# EAGLE design Interface (EAGLE 9.2.2)
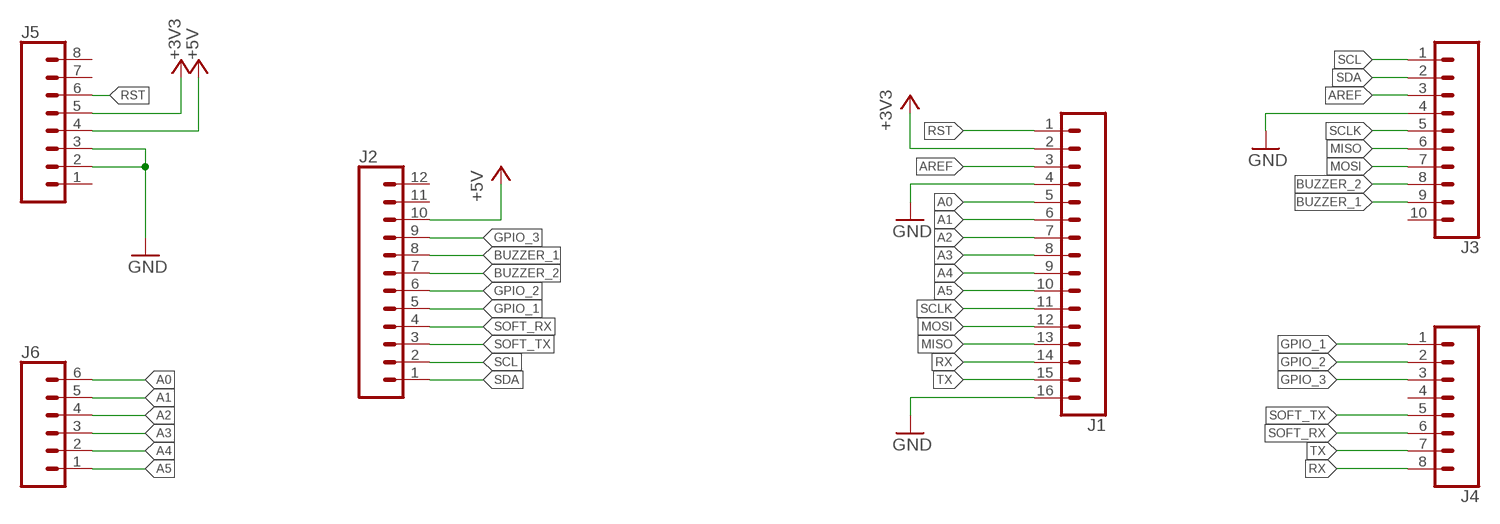
[diagram p0: schematic, sheet 1]

## Parts
J1  CONN_16  [1X16]
J2  CONN_12  [1X12]
J3  CONN_10"  [1X10]
J4  CONN_08"  [1X08]
J5  CONN_08"  [1X08]
J6  CONN_06SILK_FEMALE_PTH  [1X06]

## Nets
+3V3: J1.2 J5.5
+5V: J2.10 J5.4
A0: J1.5 J6.6
A1: J1.6 J6.5
A2: J1.7 J6.4
A3: J1.8 J6.3
A4: J1.9 J6.2
A5: J1.10 J6.1
AREF: J1.3 J3.3
BUZZER_1: J2.8 J3.9
BUZZER_2: J2.7 J3.8
GND: J1.4 J1.16 J3.4 J5.2 J5.3
GPIO_1: J2.5 J4.1
GPIO_2: J2.6 J4.2
GPIO_3: J2.9 J4.3
MISO: J1.13 J3.6
MOSI: J1.12 J3.7
RST: J1.1 J5.6
RX: J1.14 J4.8
SCL: J2.2 J3.1
SCLK: J1.11 J3.5
SDA: J2.1 J3.2
SOFT_RX: J2.4 J4.6
SOFT_TX: J2.3 J4.5
TX: J1.15 J4.7
Unconnected: J2.11 J2.12 J3.10 J4.4 J5.1 J5.7 J5.8

## Library data of the parts
J1 = SparkFun-Connectors:CONN_16: Multi connection point. Often used as Generic Header-pin footprint for 0.1 inch spaced/style header connections On any of the 0.1 inch spaced packages, you can populate with these: Break Away Headers - Straight <https://www.sparkfun.com/products/116> (PRT-00116) Break Away Male Headers - Right Angle <https://www.sparkfun.com/products/553> (PRT-00553) Female Headers <https://www.sparkfun.com/products/115> (PRT-00115) Break Away Headers - Machine Pin <https://www.sparkfun.com/products/117> (PRT-00117) Break Away Female Headers - Swiss Machine Pin <https://www.sparkfun.com/products/743> (PRT-00743) For SCREWTERMINALS and SPRING TERMINALS visit here: Screw Terimnals on SparkFun.com <https://www.sparkfun.com/search/results?term=Screw+Terminals> (5mm/3.5mm/2.54mm spacing) This device is also useful as a general connection point to wire up your design to another part of your project. Our various solder wires solder well into these plated through hole pads. Hook-Up Wire - Assortment (Stranded, 22 AWG) <https://www.sparkfun.com/products/11375> (PRT-11375) Hook-Up Wire - Assortment (Solid Core, 22 AWG) <https://www.sparkfun.com/products/11367> (PRT-11367) View the entire wire category on our website here <https://www.sparkfun.com/categories/141> Special notes: Molex polarized connector foot print use with SKU : PRT-08231 with associated crimp pins and housings. 1MM SMD Version SKU: PRT-10208 NOTES ON THE VARIANTS LOCK and LOCK_LONGPADS... This footprint was designed to help hold the alignment of a through-hole component (i.e. 6-pin header) while soldering it into place. You may notice that each hole has been shifted either up or down by 0.005 of an inch from it's more standard position (which is a perfectly straight line). This slight alteration caused the pins (the squares in the middle) to touch the edges of the holes. Because they are alternating, it causes a "brace" to hold the component in place. 0.005 has proven to be the perfect amount of "off-center" position when using our standard breakaway headers. Although looks a little odd when you look at the bare footprint, once you have a header in there, the alteration is very hard to notice. Also,if you push a header all the way into place, it is covered up entirely on the bottom side.
J2 = SparkFun-Connectors:CONN_12: Multi connection point. Often used as Generic Header-pin footprint for 0.1 inch spaced/style header connections On any of the 0.1 inch spaced packages, you can populate with these: Break Away Headers - Straight <https://www.sparkfun.com/products/116> (PRT-00116) Break Away Male Headers - Right Angle <https://www.sparkfun.com/products/553> (PRT-00553) Female Headers <https://www.sparkfun.com/products/115> (PRT-00115) Break Away Headers - Machine Pin <https://www.sparkfun.com/products/117> (PRT-00117) Break Away Female Headers - Swiss Machine Pin <https://www.sparkfun.com/products/743> (PRT-00743) For SCREWTERMINALS and SPRING TERMINALS visit here: Screw Terimnals on SparkFun.com <https://www.sparkfun.com/search/results?term=Screw+Terminals> (5mm/3.5mm/2.54mm spacing) This device is also useful as a general connection point to wire up your design to another part of your project. Our various solder wires solder well into these plated through hole pads. Hook-Up Wire - Assortment (Stranded, 22 AWG) <https://www.sparkfun.com/products/11375> (PRT-11375) Hook-Up Wire - Assortment (Solid Core, 22 AWG) <https://www.sparkfun.com/products/11367> (PRT-11367) View the entire wire category on our website here <https://www.sparkfun.com/categories/141> Special notes: Molex polarized connector foot print use with SKU : PRT-08231 with associated crimp pins and housings. 1MM SMD Version SKU: PRT-10208 NOTES ON THE VARIANTS LOCK and LOCK_LONGPADS... This footprint was designed to help hold the alignment of a through-hole component (i.e. 6-pin header) while soldering it into place. You may notice that each hole has been shifted either up or down by 0.005 of an inch from it's more standard position (which is a perfectly straight line). This slight alteration caused the pins (the squares in the middle) to touch the edges of the holes. Because they are alternating, it causes a "brace" to hold the component in place. 0.005 has proven to be the perfect amount of "off-center" position when using our standard breakaway headers. Although looks a little odd when you look at the bare footprint, once you have a header in there, the alteration is very hard to notice. Also,if you push a header all the way into place, it is covered up entirely on the bottom side.
J3 = SparkFun-Connectors:CONN_10: Multi connection point. Often used as Generic Header-pin footprint for 0.1 inch spaced/style header connections On any of the 0.1 inch spaced packages, you can populate with these: Break Away Headers - Straight <https://www.sparkfun.com/products/116> (PRT-00116) Break Away Male Headers - Right Angle <https://www.sparkfun.com/products/553> (PRT-00553) Female Headers <https://www.sparkfun.com/products/115> (PRT-00115) Break Away Headers - Machine Pin <https://www.sparkfun.com/products/117> (PRT-00117) Break Away Female Headers - Swiss Machine Pin <https://www.sparkfun.com/products/743> (PRT-00743) Arduino Stackable Header - 10 Pin <https://www.sparkfun.com/products/11376> (PRT-11376) For SCREWTERMINALS and SPRING TERMINALS visit here: Screw Terimnals on SparkFun.com <https://www.sparkfun.com/search/results?term=Screw+Terminals> (5mm/3.5mm/2.54mm spacing) This device is also useful as a general connection point to wire up your design to another part of your project. Our various solder wires solder well into these plated through hole pads. Hook-Up Wire - Assortment (Stranded, 22 AWG) <https://www.sparkfun.com/products/11375> (PRT-11375) Hook-Up Wire - Assortment (Solid Core, 22 AWG) <https://www.sparkfun.com/products/11367> (PRT-11367) View the entire wire category on our website here <https://www.sparkfun.com/categories/141> Special notes: Molex polarized connector foot print use with SKU : PRT-08231 with associated crimp pins and housings. 1MM SMD Version SKU: PRT-10208 NOTES ON THE VARIANTS LOCK and LOCK_LONGPADS... This footprint was designed to help hold the alignment of a through-hole component (i.e. 6-pin header) while soldering it into place. You may notice that each hole has been shifted either up or down by 0.005 of an inch from it's more standard position (which is a perfectly straight line). This slight alteration caused the pins (the squares in the middle) to touch the edges of the holes. Because they are alternating, it causes a "brace" to hold the component in place. 0.005 has proven to be the perfect amount of "off-center" position when using our standard breakaway headers. Although looks a little odd when you look at the bare footprint, once you have a header in there, the alteration is very hard to notice. Also,if you push a header all the way into place, it is covered up entirely on the bottom side.; PROD_ID: CONN-11563
J4 J5 = SparkFun-Connectors:CONN_08: Multi connection point. Often used as Generic Header-pin footprint for 0.1 inch spaced/style header connections On any of the 0.1 inch spaced packages, you can populate with these: Break Away Headers - Straight <https://www.sparkfun.com/products/116> (PRT-00116) Break Away Male Headers - Right Angle <https://www.sparkfun.com/products/553> (PRT-00553) Female Headers <https://www.sparkfun.com/products/115> (PRT-00115) Break Away Headers - Machine Pin <https://www.sparkfun.com/products/117> (PRT-00117) Break Away Female Headers - Swiss Machine Pin <https://www.sparkfun.com/products/743> (PRT-00743) Arduino Stackable Header - 8 Pin <https://www.sparkfun.com/products/9279> (PRT-09279) For SCREWTERMINALS and SPRING TERMINALS visit here: Screw Terimnals on SparkFun.com <https://www.sparkfun.com/search/results?term=Screw+Terminals> (5mm/3.5mm/2.54mm spacing) This device is also useful as a general connection point to wire up your design to another part of your project. Our various solder wires solder well into these plated through hole pads. Hook-Up Wire - Assortment (Stranded, 22 AWG) <https://www.sparkfun.com/products/11375> (PRT-11375) Hook-Up Wire - Assortment (Solid Core, 22 AWG) <https://www.sparkfun.com/products/11367> (PRT-11367) View the entire wire category on our website here <https://www.sparkfun.com/categories/141> Special notes: Molex polarized connector foot print use with SKU : PRT-08231 with associated crimp pins and housings. 1MM SMD Version SKU: PRT-10208 NOTES ON THE VARIANTS LOCK and LOCK_LONGPADS... This footprint was designed to help hold the alignment of a through-hole component (i.e. 6-pin header) while soldering it into place. You may notice that each hole has been shifted either up or down by 0.005 of an inch from it's more standard position (which is a perfectly straight line). This slight alteration caused the pins (the squares in the middle) to touch the edges of the holes. Because they are alternating, it causes a "brace" to hold the component in place. 0.005 has proven to be the perfect amount of "off-center" position when using our standard breakaway headers. Although looks a little odd when you look at the bare footprint, once you have a header in there, the alteration is very hard to notice. Also,if you push a header all the way into place, it is covered up entirely on the bottom side.; PROD_ID: CONN-08438
J6 = SparkFun-Connectors:CONN_06: Multi connection point. Often used as Generic Header-pin footprint for 0.1 inch spaced/style header connections On any of the 0.1 inch spaced packages, you can populate with these: Break Away Headers - Straight <https://www.sparkfun.com/products/116> (PRT-00116) Break Away Male Headers - Right Angle <https://www.sparkfun.com/products/553> (PRT-00553) Female Headers <https://www.sparkfun.com/products/115> (PRT-00115) Break Away Headers - Machine Pin <https://www.sparkfun.com/products/117> (PRT-00117) Break Away Female Headers - Swiss Machine Pin <https://www.sparkfun.com/products/743> (PRT-00743) Arduino Stackable Header - 6 Pin <https://www.sparkfun.com/products/9280> (PRT-09280) For SCREWTERMINALS and SPRING TERMINALS visit here: Screw Terimnals on SparkFun.com <https://www.sparkfun.com/search/results?term=Screw+Terminals> (5mm/3.5mm/2.54mm spacing) This device is also useful as a general connection point to wire up your design to another part of your project. Our various solder wires solder well into these plated through hole pads. Hook-Up Wire - Assortment (Stranded, 22 AWG) <https://www.sparkfun.com/products/11375> (PRT-11375) Hook-Up Wire - Assortment (Solid Core, 22 AWG) <https://www.sparkfun.com/products/11367> (PRT-11367) View the entire wire category on our website here <https://www.sparkfun.com/categories/141>; PROD_ID: CONN-08437

## Board
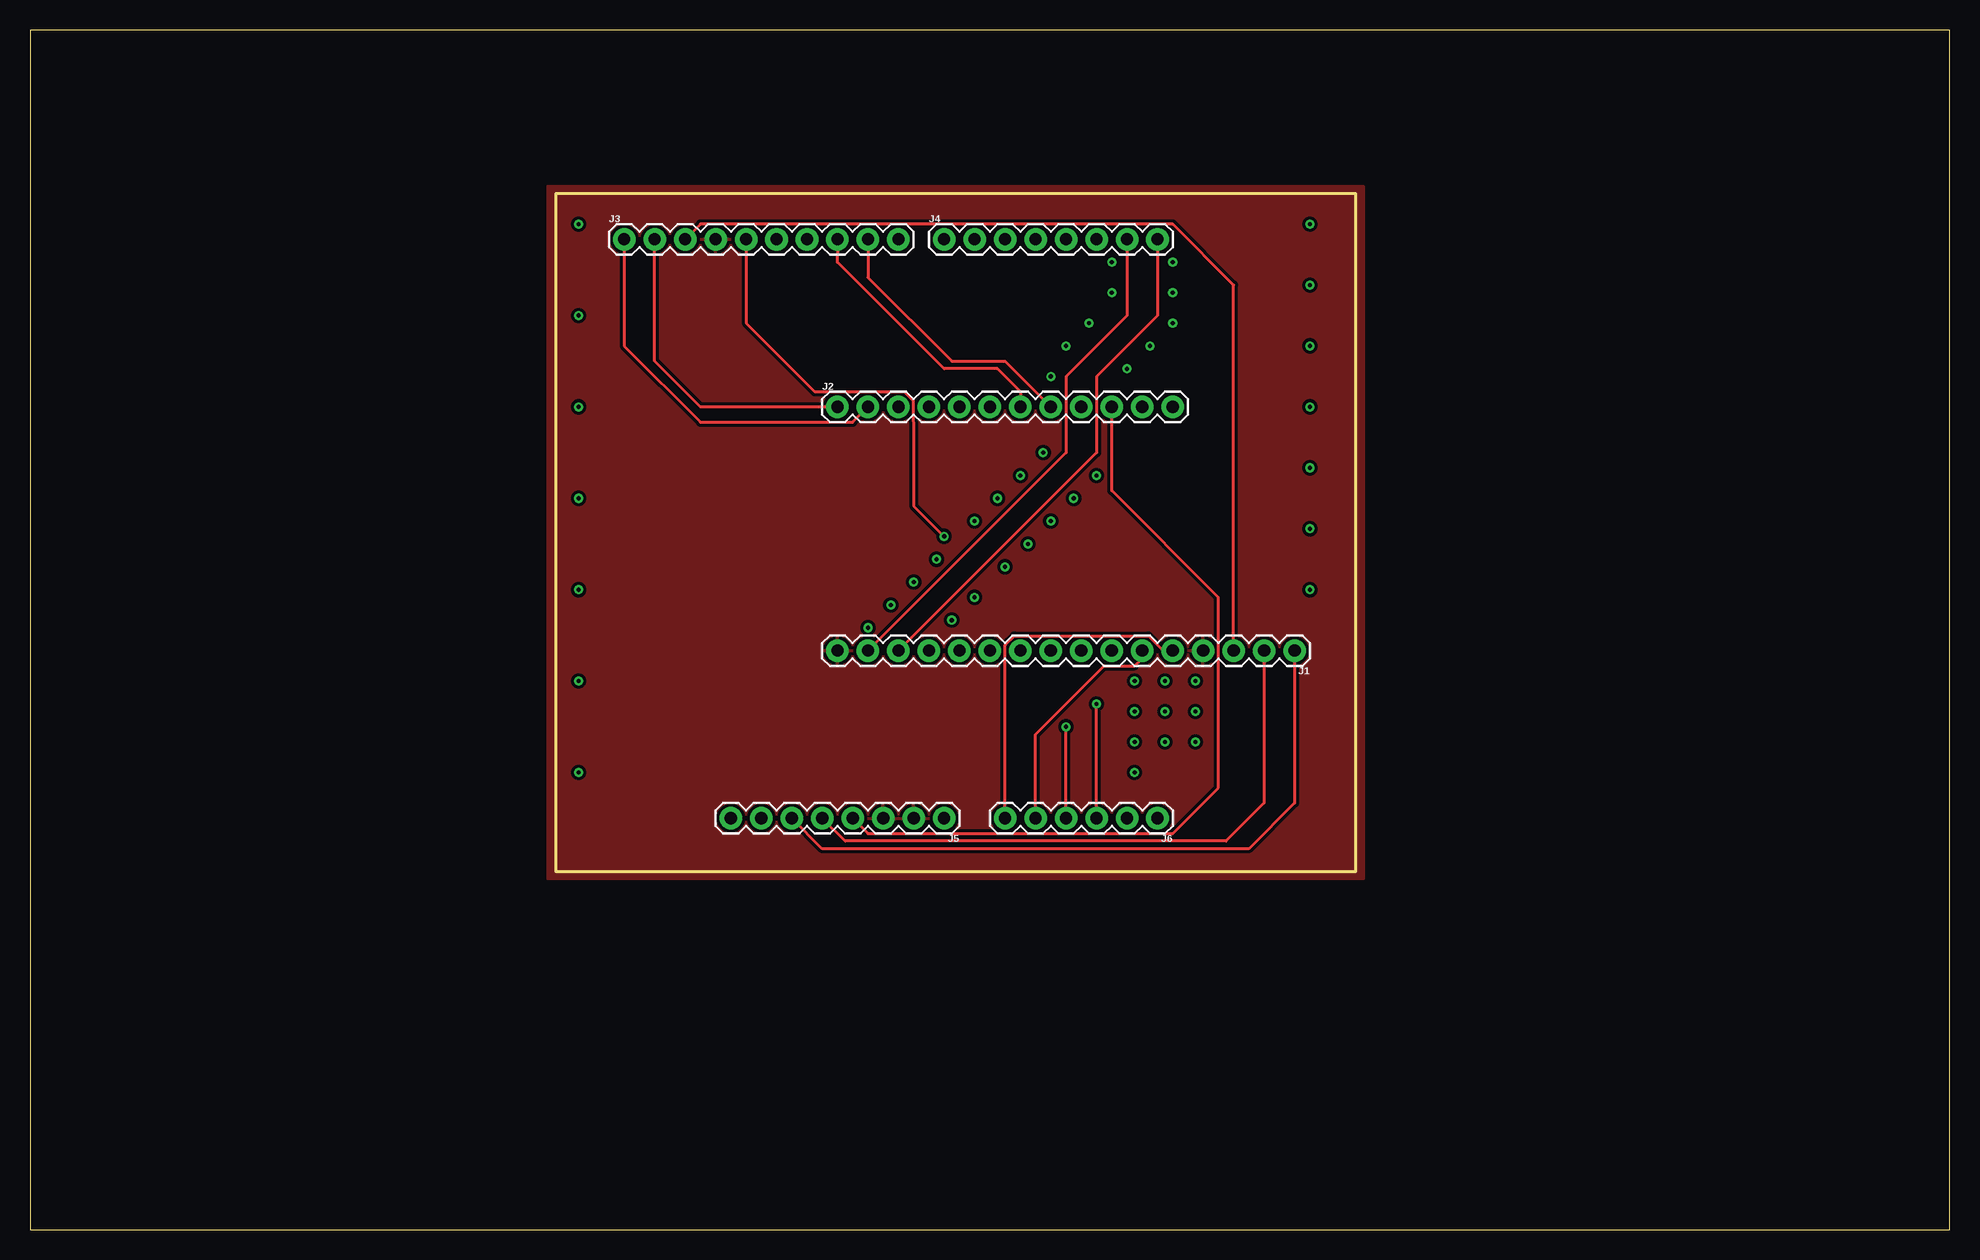
[diagram p1: board, top side]
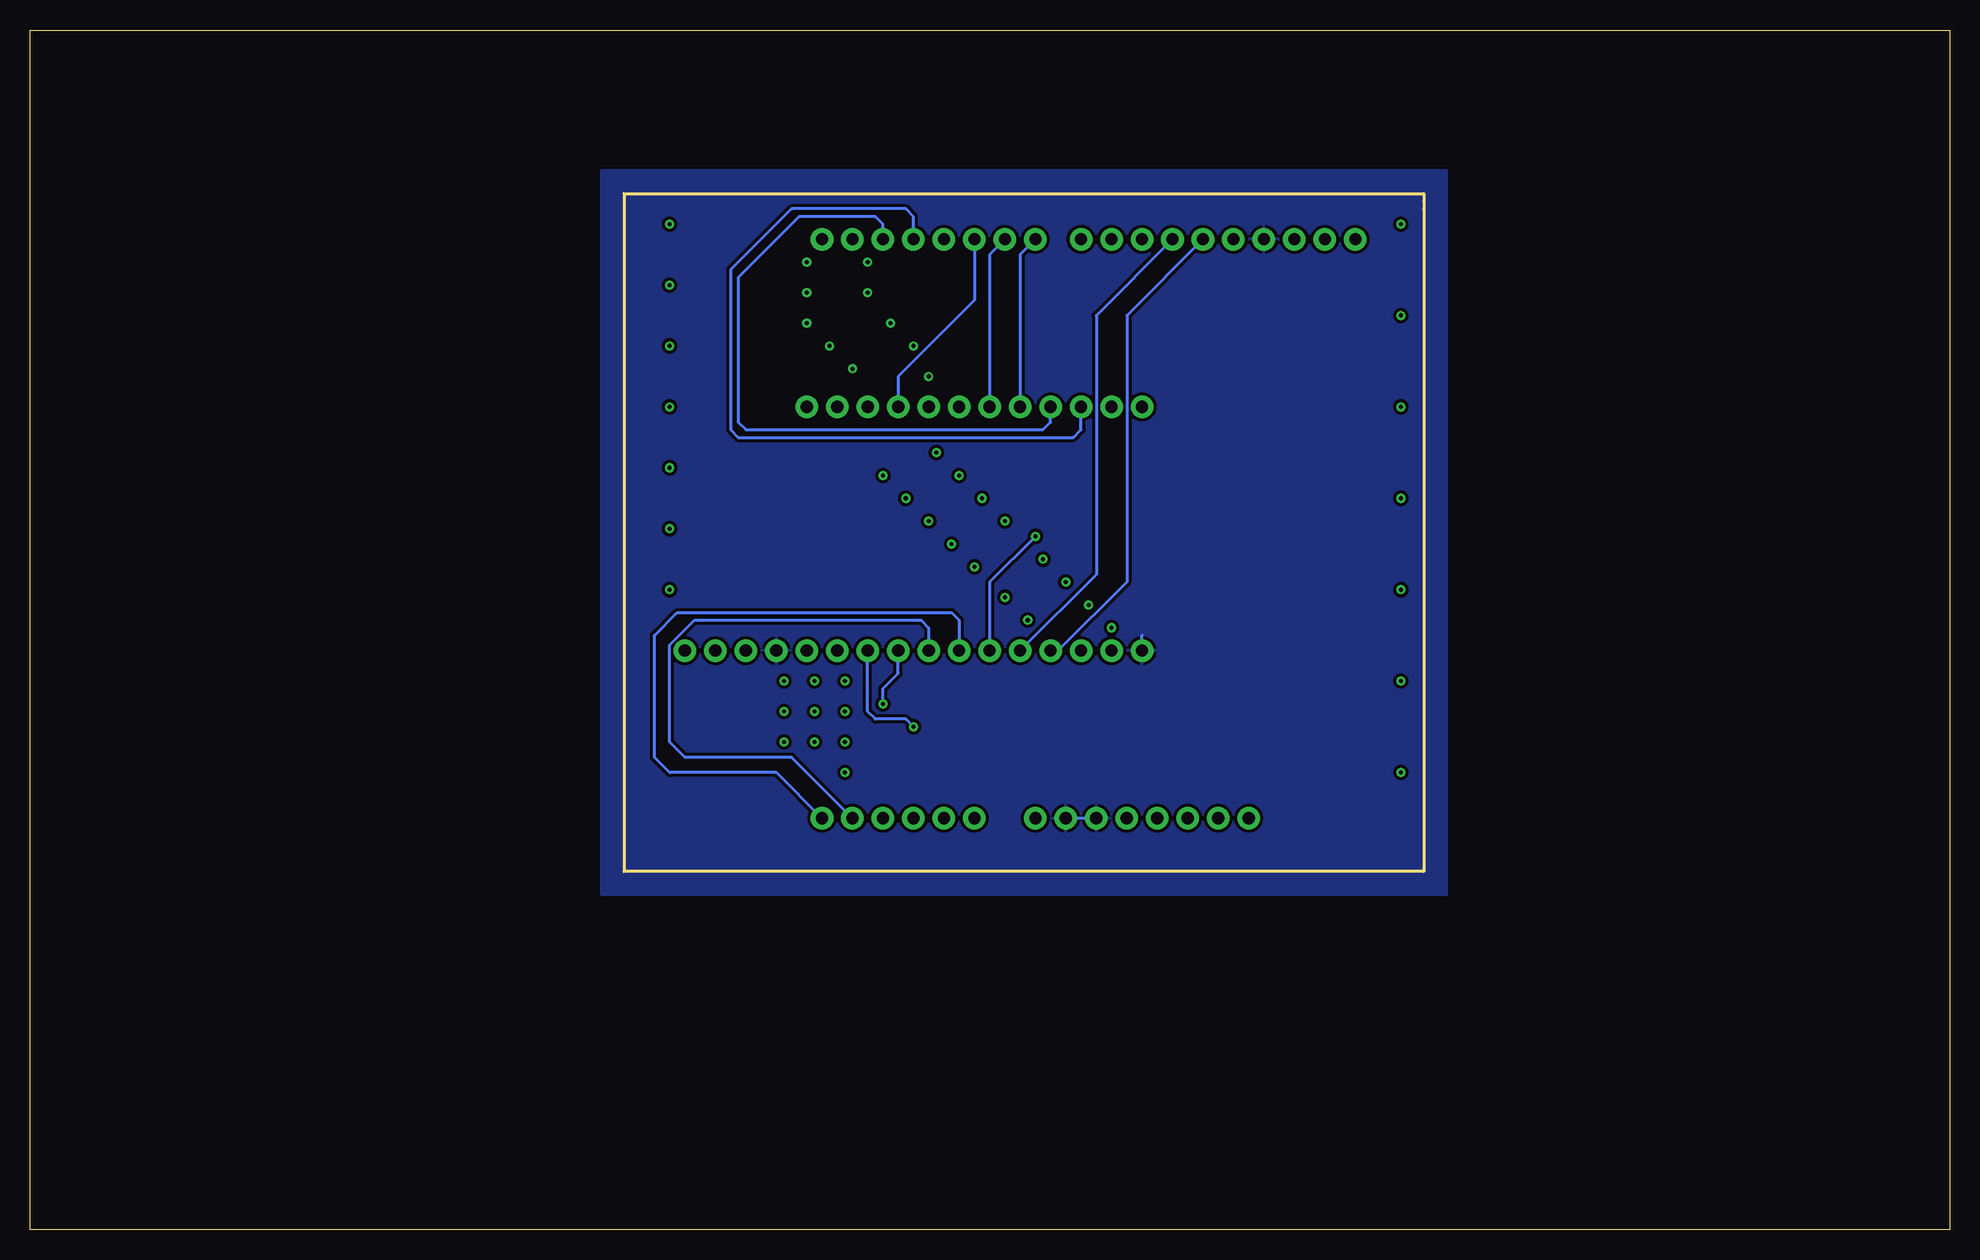
[diagram p2: board, bottom side, seen from below]

Size 160 x 100 mm. Coordinates in mm from the lower left corner, seen from the top.
Outline: 0,0 160,0 160,100 0,100 0,0
Outline: 43.81,85.72 43.81,85.09 43.81,29.84 110.49,29.84 110.49,86.36 43.81,86.36 43.81,85.72
Copper layers (1*16): Top 0.035mm / dielectric 1.5mm / Bottom 0.035mm
Design rules "default *": minimum track width 6mil, minimum drill 0.35mm, track to track 10mil, track to pad 6mil, pad to pad 6mil, via to via 6mil, smd to smd 6mil, copper to edge 0mil, drill to drill 6mil, minimum pad ring 10mil, minimum via ring 8mil, stop-mask expansion 4mil, vias tented up to drill 0mil, thermal gap 10mil

### Footprints (pad centres in the part's own frame; a part is rotated, then mirrored left to right if it is on the bottom)
1X16 = drill 1.016 pad 1.88: 1 0,0; 2 2.54,0; 3 5.08,0; 4 7.62,0; 5 10.16,0; 6 12.7,0; 7 15.24,0; 8 17.78,0; 9 20.32,0; 10 22.86,0; 11 25.4,0; 12 27.94,0; 13 30.48,0; 14 33.02,0; 15 35.56,0; 16 38.1,0
1X12 = drill 1.016 pad 1.88: 1 0,0; 2 2.54,0; 3 5.08,0; 4 7.62,0; 5 10.16,0; 6 12.7,0; 7 15.24,0; 8 17.78,0; 9 20.32,0; 10 22.86,0; 11 25.4,0; 12 27.94,0
1X10 = drill 1.016 pad 1.88: 1 0,0; 2 2.54,0; 3 5.08,0; 4 7.62,0; 5 10.16,0; 6 12.7,0; 7 15.24,0; 8 17.78,0; 9 20.32,0; 10 22.86,0
1X08 = drill 1.016 pad 1.88: 1 0,0; 2 2.54,0; 3 5.08,0; 4 7.62,0; 5 10.16,0; 6 12.7,0; 7 15.24,0; 8 17.78,0
1X06 = drill 1.016 pad 1.88: 1 0,0; 2 2.54,0; 3 5.08,0; 4 7.62,0; 5 10.16,0; 6 12.7,0

### Placement (x,y rotation side)
J1  105.41,48.26 180 top
J2  67.31,68.58 0 top
J3  49.53,82.55 0 top
J4  76.2,82.55 0 top
J5  76.2,34.29 180 top
J6  93.98,34.29 180 top

### Tracks (layer width: path | path; a pad name or v marks a point on that pad's centre or on a via)
+3V3
  Top 0.254: J1.2 102.87,35.56 99.69,32.38 67.94,32.38 J5.5
+5V
  Top 0.254: J5.4 69.85,33.02 95.25,33.02 99.06,36.83 99.06,52.7 90.17,61.59 J2.10
A0
  Top 0.254: J1.5 94.43,48.26 93.22,49.48 82.05,49.48 81.28,48.71 J6.6
A1
  Top 0.254: J6.5 83.82,41.27 89.53,46.99 92.08,46.99 92.71,47.62 J1.6
A2  (via drill 0.35)
  Top 0.254: J6.4 v86.36,41.91
  Bottom 0.254: v86.36,41.91 87,42.55 89.53,42.55 90.17,43.18 J1.7
A3  (via drill 0.35)
  Top 0.254: J6.3 v88.9,43.81
  Bottom 0.254: v88.9,43.81 88.9,45.09 87.63,46.35 J1.8
A4
  Bottom 0.254: J6.2 96.52,39.37 105.41,39.37 106.68,40.64 106.68,48.71 104.59,50.8 85.72,50.8 85.09,50.16 J1.9
A5
  Bottom 0.254: J6.1 97.79,38.1 106.68,38.1 107.95,39.37 107.95,49.53 106.05,51.44 83.19,51.44 82.55,50.8 J1.10
AREF
  Top 0.254: J1.3 100.33,78.74 95.25,83.82 55.88,83.82 J3.3
BUZZER_1
  Top 0.254: J2.8 81.28,72.39 76.83,72.39 69.85,79.38 J3.9
BUZZER_2
  Top 0.254: J3.8 67.31,81.92 67.31,81.28 67.31,80.64 76.2,71.75 80.64,71.75 82.55,69.85 J2.7
GND
  Bottom 0.254: J5.3 J5.2 | J1.16 67.31,49.53
  pour Top: 43.18,87 111.12,87 111.12,29.21 43.18,29.21
  pour Bottom: 41.91,88.27 112.39,88.27 112.39,27.94 41.91,27.94
GPIO_1
  Bottom 0.254: J4.1 77.47,81.28 J2.5
GPIO_2
  Bottom 0.254: J4.2 80.01,81.28 J2.6
GPIO_3
  Bottom 0.254: J4.3 81.28,77.47 87.63,71.12 J2.9
MISO
  Bottom 0.254: J3.6 68.58,76.2 68.58,53.98 74.3,48.26 J1.13
MOSI
  Bottom 0.254: J3.7 71.12,76.2 71.12,54.61 J1.12
N$1  (via drill 0.35)
  other vias: 45.72,83.82
N$4  (via drill 0.35)
  other vias: 45.72,76.2
N$7  (via drill 0.35)
  other vias: 45.72,68.58
N$10  (via drill 0.35)
  other vias: 45.72,60.96
N$14  (via drill 0.35)
  other vias: 45.72,53.34
N$15  (via drill 0.35)
  other vias: 45.72,45.72
N$16  (via drill 0.35)
  other vias: 45.72,38.1
N$17  (via drill 0.35)
  other vias: 106.68,83.82
N$18  (via drill 0.35)
  other vias: 106.68,78.74
N$19  (via drill 0.35)
  other vias: 106.68,73.66
N$20  (via drill 0.35)
  other vias: 106.68,68.58
N$21  (via drill 0.35)
  other vias: 106.68,63.5
N$22  (via drill 0.35)
  other vias: 106.68,58.42
N$23  (via drill 0.35)
  other vias: 106.68,53.34
N$24  (via drill 0.35)
  other vias: 95.25,80.64
N$31  (via drill 0.35)
  other vias: 95.25,78.11
N$32  (via drill 0.35)
  other vias: 95.25,75.56
N$36  (via drill 0.35)
  other vias: 93.34,73.66
N$37  (via drill 0.35)
  other vias: 91.44,71.75
N$38  (via drill 0.35)
  other vias: 88.9,62.87
N$39  (via drill 0.35)
  other vias: 87,60.96
N$40  (via drill 0.35)
  other vias: 85.09,59.05
N$41  (via drill 0.35)
  other vias: 83.19,57.15
N$42  (via drill 0.35)
  other vias: 81.28,55.24
N$43  (via drill 0.35)
  other vias: 78.74,52.7
N$44  (via drill 0.35)
  other vias: 76.83,50.8
N$45  (via drill 0.35)
  other vias: 84.45,64.77
N$46  (via drill 0.35)
  other vias: 82.55,62.87
N$47  (via drill 0.35)
  other vias: 80.64,60.96
N$48  (via drill 0.35)
  other vias: 78.74,59.05
N$49  (via drill 0.35)
  other vias: 75.56,55.88
N$50  (via drill 0.35)
  other vias: 73.66,53.98
N$51  (via drill 0.35)
  other vias: 69.85,50.16
N$52  (via drill 0.35)
  other vias: 71.75,52.07
N$53  (via drill 0.35)
  other vias: 90.17,80.64
N$54  (via drill 0.35)
  other vias: 90.17,78.11
N$55  (via drill 0.35)
  other vias: 88.27,75.56
N$56  (via drill 0.35)
  other vias: 86.36,73.66
N$57  (via drill 0.35)
  other vias: 85.09,71.12
N$58  (via drill 0.35)
  other vias: 94.61,43.18
N$59  (via drill 0.35)
  other vias: 94.61,40.64
N$60  (via drill 0.35)
  other vias: 92.08,43.18
N$61  (via drill 0.35)
  other vias: 92.08,40.64
N$63  (via drill 0.35)
  other vias: 97.16,43.18
N$64  (via drill 0.35)
  other vias: 97.16,40.64
N$65  (via drill 0.35)
  other vias: 97.16,45.72
N$66  (via drill 0.35)
  other vias: 94.61,45.72
N$67  (via drill 0.35)
  other vias: 92.08,45.72
N$68  (via drill 0.35)
  other vias: 92.08,38.1
RST
  Top 0.254: J5.6 66.04,31.75 101.6,31.75 105.41,35.56 J1.1
RX
  Top 0.254: J4.8 93.98,76.2 88.9,71.12 88.9,64.77 J1.14
SCL
  Top 0.254: J3.1 49.53,73.66 55.88,67.31 68.58,67.31 J2.2
SCLK  (via drill 0.35)
  Top 0.254: J3.5 59.69,75.56 65.41,69.85 72.84,69.85 73.61,69.08 73.61,67.36 73.66,67.31 73.66,60.33 v76.2,57.78
  Bottom 0.254: v76.2,57.78 80.01,53.98 J1.11
SDA
  Top 0.254: J2.1 55.88,68.58 52.07,72.39 J3.2
SOFT_RX
  Bottom 0.254: J4.6 88.9,83.82 89.53,84.45 95.89,84.45 100.97,79.38 100.97,67.31 100.33,66.67 75.56,66.67 74.93,67.31 J2.4
SOFT_TX
  Bottom 0.254: J4.5 86.36,84.45 87,85.09 96.52,85.09 101.6,80.01 101.6,66.67 100.97,66.04 73.03,66.04 72.39,66.67 J2.3
TX
  Top 0.254: J4.7 91.44,76.2 86.36,71.12 86.36,64.77 J1.15